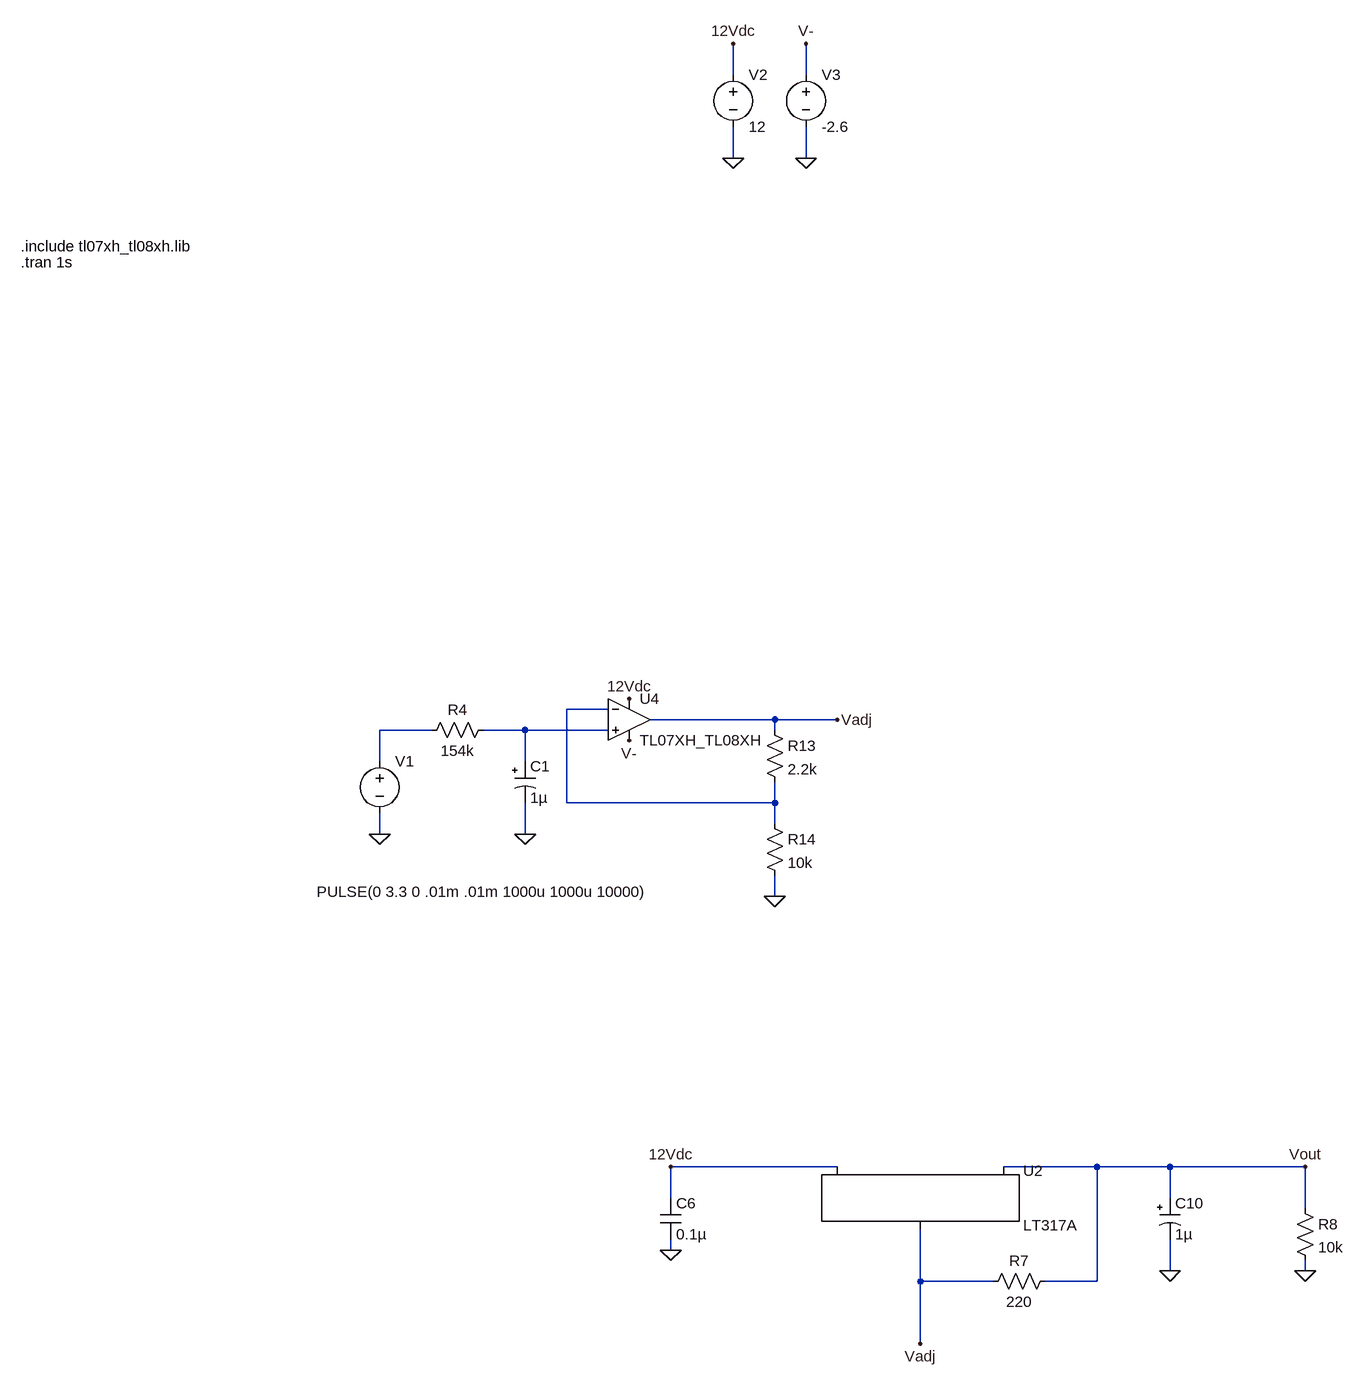
[diagram p0: schematic adj_voltage(1,25-5v).asc]
adj_voltage(1,25-5v).asc, the LTspice schematic file:
Version 4
SHEET 1 4228 3264
WIRE 656 768 656 720
WIRE 768 768 768 720
WIRE 656 896 656 848
WIRE 768 896 768 848
WIRE 464 1744 400 1744
WIRE 720 1760 528 1760
WIRE 816 1760 720 1760
WIRE 192 1776 112 1776
WIRE 336 1776 272 1776
WIRE 464 1776 336 1776
WIRE 720 1776 720 1760
WIRE 112 1824 112 1776
WIRE 336 1824 336 1776
WIRE 400 1888 400 1744
WIRE 720 1888 720 1856
WIRE 720 1888 400 1888
WIRE 720 1920 720 1888
WIRE 112 1936 112 1904
WIRE 336 1936 336 1888
WIRE 720 2032 720 2000
WIRE 816 2448 560 2448
WIRE 1216 2448 1072 2448
WIRE 1328 2448 1216 2448
WIRE 1536 2448 1328 2448
WIRE 560 2496 560 2448
WIRE 1328 2496 1328 2448
WIRE 1536 2512 1536 2448
WIRE 560 2576 560 2560
WIRE 1328 2608 1328 2560
WIRE 1536 2608 1536 2592
WIRE 944 2624 944 2544
WIRE 1056 2624 944 2624
WIRE 1216 2624 1216 2448
WIRE 1216 2624 1136 2624
WIRE 944 2720 944 2624
FLAG 560 2576 0
FLAG 1328 2608 0
FLAG 1536 2608 0
FLAG 560 2448 12Vdc
FLAG 112 1936 0
FLAG 336 1936 0
FLAG 1536 2448 Vout
FLAG 944 2720 Vadj
FLAG 496 1728 12Vdc
FLAG 720 2032 0
FLAG 656 896 0
FLAG 656 720 12Vdc
FLAG 768 896 0
FLAG 768 720 V-
FLAG 496 1792 V-
FLAG 816 1760 Vadj
SYMBOL PowerProducts\\LT317A 944 2448 R0
SYMATTR InstName U2
SYMBOL res 1152 2608 R90
WINDOW 0 0 56 VBottom 2
WINDOW 3 32 56 VTop 2
SYMATTR InstName R7
SYMATTR Value 220
SYMBOL res 1520 2496 R0
SYMATTR InstName R8
SYMATTR Value 10k
SYMBOL polcap 1312 2496 R0
SYMATTR InstName C10
SYMATTR Value 1µ
SYMATTR SpiceLine V=16
SYMBOL cap 544 2496 R0
SYMATTR InstName C6
SYMATTR Value 0.1µ
SYMATTR SpiceLine V=16
SYMBOL voltage 112 1808 R0
WINDOW 3 -97 217 Left 2
WINDOW 123 0 0 Left 0
WINDOW 39 0 0 Left 0
SYMATTR Value PULSE(0 3.3 0 .01m .01m 1000u 1000u 10000)
SYMATTR InstName V1
SYMBOL res 288 1760 R90
WINDOW 0 0 56 VBottom 2
WINDOW 3 32 56 VTop 2
SYMATTR InstName R4
SYMATTR Value 154k
SYMBOL OpAmps\\opamp2 496 1696 R0
SYMATTR InstName U4
SYMATTR Value TL07XH_TL08XH
SYMBOL res 704 1760 R0
SYMATTR InstName R13
SYMATTR Value 2.2k
SYMBOL res 704 1904 R0
SYMATTR InstName R14
SYMATTR Value 10k
SYMBOL voltage 656 752 R0
WINDOW 123 0 0 Left 0
WINDOW 39 0 0 Left 0
SYMATTR InstName V2
SYMATTR Value 12
SYMBOL voltage 768 752 R0
WINDOW 123 0 0 Left 0
WINDOW 39 0 0 Left 0
SYMATTR InstName V3
SYMATTR Value -2.6
SYMBOL polcap 320 1824 R0
SYMATTR InstName C1
SYMATTR Value 1µ
TEXT -440 1056 Left 2 !.tran 1s
TEXT -440 1032 Left 2 !.include tl07xh_tl08xh.lib

The netlist it stands for:
* adj_voltage(1,25-5v).asc
XU2 Vadj Vout 12Vdc LT317A
R7 Vout Vadj 220
R8 Vout 0 10k
C10 Vout 0 1µ V=16
C6 12Vdc 0 0.1µ V=16
V1 N002 0 PULSE(0 3.3 0 .01m .01m 1000u 1000u 10000)
R4 N003 N002 154k
XU4 N003 N001 12Vdc V- Vadj TL07XH_TL08XH  ; pins In+ In- V+ V- OUT
R13 Vadj N001 2.2k
R14 N001 0 10k
V2 12Vdc 0 12
V3 V- 0 -2.6
C1 N003 0 1µ
.tran 1s
.include tl07xh_tl08xh.lib
.lib LTC.lib
.backanno
.end